# Altium project IMX8SoCIot.PrjPcb (part 3 of 4)

## Sheet IMX8_PMIC.SchDoc
size 594 x 420 mm; SheetNumber: 11; SheetTotal: 12
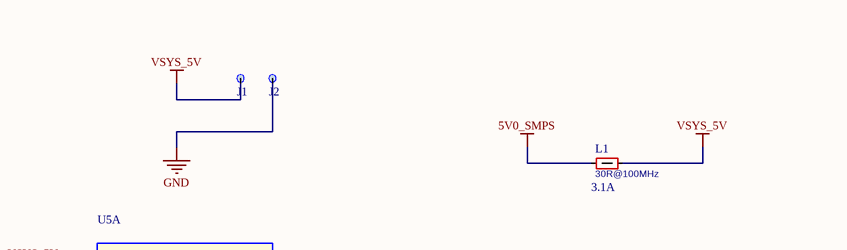
[diagram p16: IMX8_PMIC.SchDoc, top left]
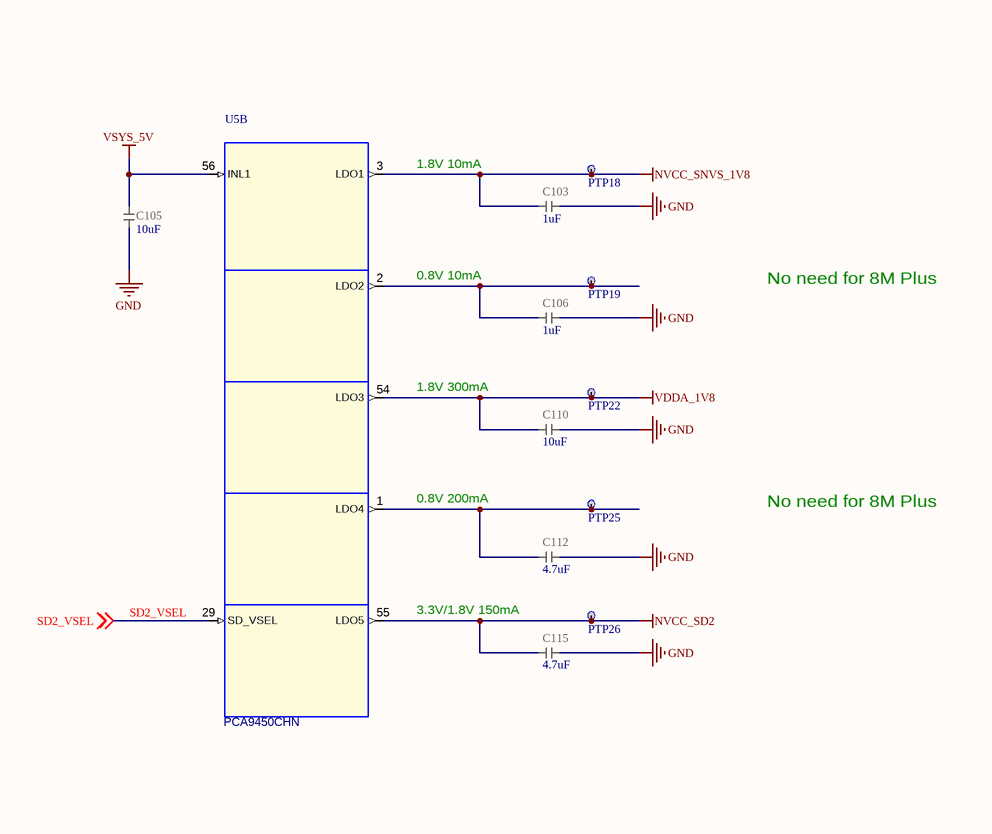
[diagram p17: IMX8_PMIC.SchDoc, top right]
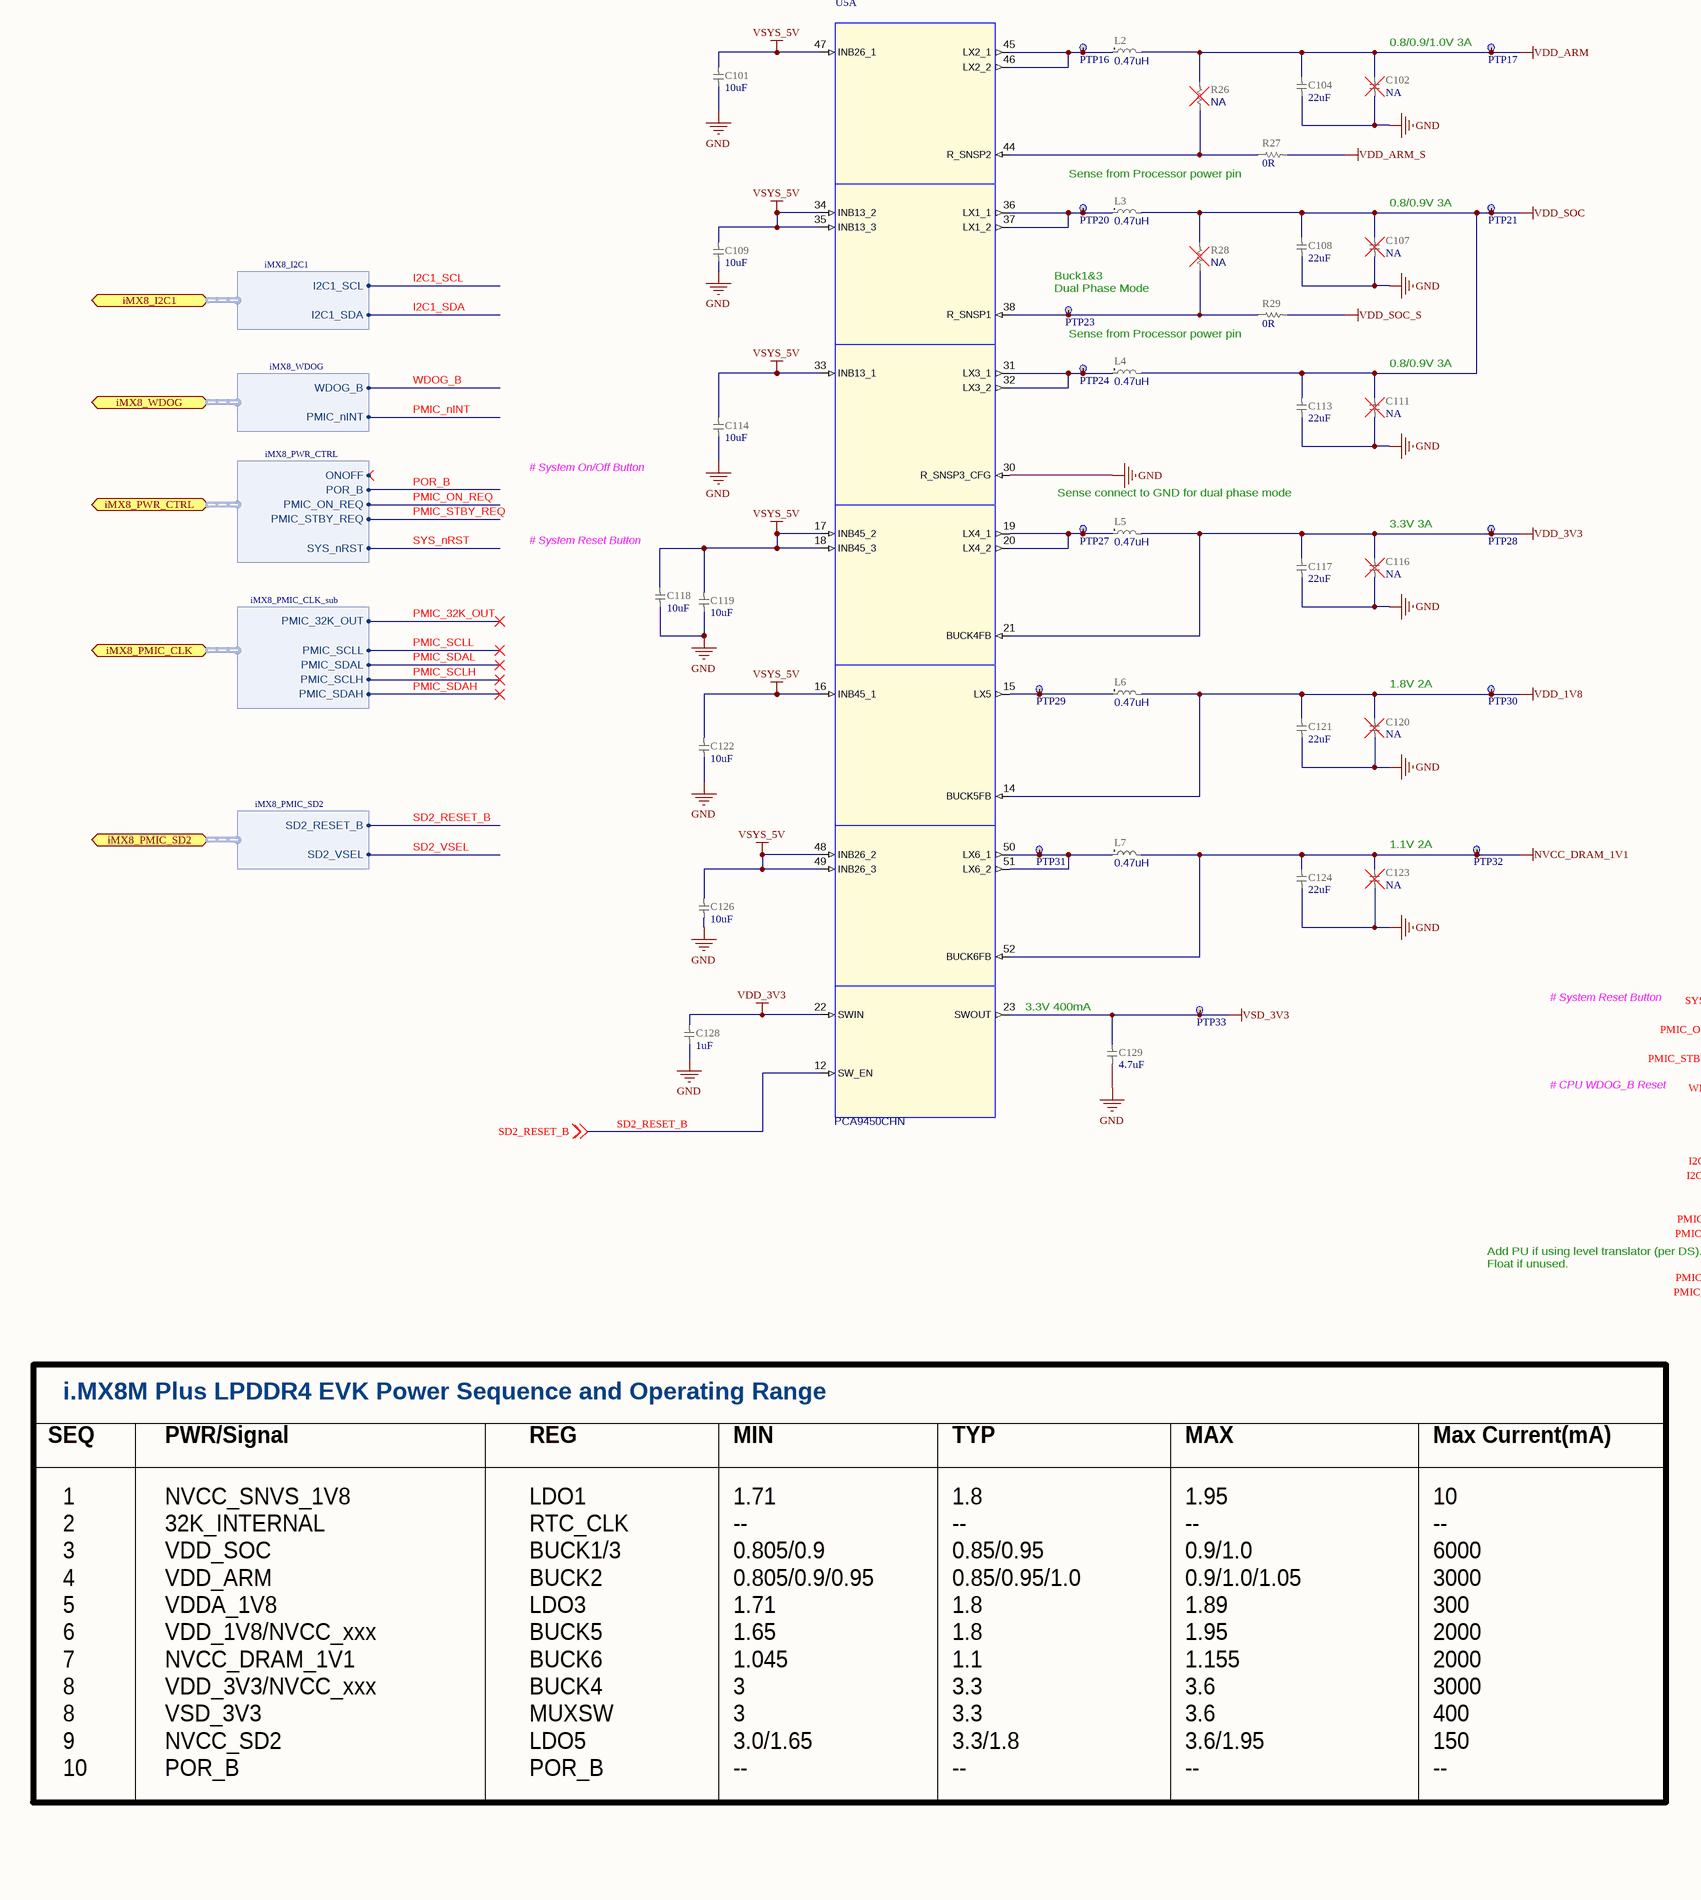
[diagram p18: IMX8_PMIC.SchDoc, bottom left]
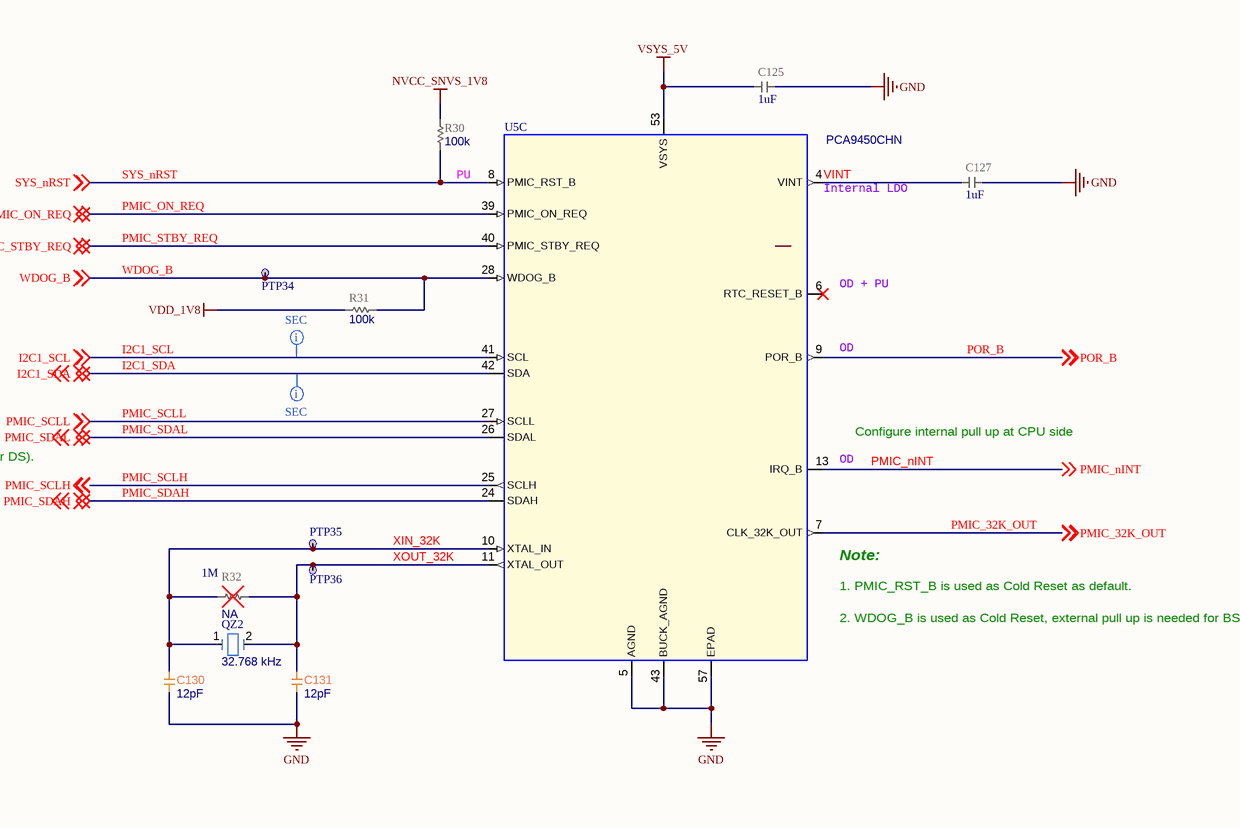
[diagram p19: IMX8_PMIC.SchDoc, bottom right]

### Parts
C101  value 10uF  [CAP_0603_UN1Q]  (hidden comment: CAP_0603_10u_10V_X7R)
C102  value NA  [CAP_0603_UN1Q]  (hidden comment: CAP_0603_NA)
C103  value 1uF  [CAP_0201_UN1Q]  (hidden comment: CAP_0201_1uF_X6S)
C104  value 22uF  [CAP_0603_UN1Q]  (hidden comment: CAP_0603_22u_6.3V_X6S)
C105  value 10uF  [CAP_0603_UN1Q]  (hidden comment: CAP_0603_10u_10V_X7R)
C106  value 1uF  [CAP_0201_UN1Q]  (hidden comment: CAP_0201_1uF_X6S)
C107  value NA  [CAP_0603_UN1Q]  (hidden comment: CAP_0603_NA)
C108  value 22uF  [CAP_0603_UN1Q]  (hidden comment: CAP_0603_22u_6.3V_X6S)
C109  value 10uF  [CAP_0603_UN1Q]  (hidden comment: CAP_0603_10u_10V_X7R)
C110  value 10uF  [CAP_0402_H09W07_UN1Q]  (hidden comment: CAP_0402_10u_X6S)
C111  value NA  [CAP_0603_UN1Q]  (hidden comment: CAP_0603_NA)
C112  value 4.7uF  [CAP_0402_H09W07_UN1Q]  (hidden comment: CAP_0402_4u7_10V_X6S)
C113  value 22uF  [CAP_0603_UN1Q]  (hidden comment: CAP_0603_22u_6.3V_X6S)
C114  value 10uF  [CAP_0603_UN1Q]  (hidden comment: CAP_0603_10u_10V_X7R)
C115  value 4.7uF  [CAP_0402_H09W07_UN1Q]  (hidden comment: CAP_0402_4u7_10V_X6S)
C116  value NA  [CAP_0603_UN1Q]  (hidden comment: CAP_0603_NA)
C117  value 22uF  [CAP_0603_UN1Q]  (hidden comment: CAP_0603_22u_6.3V_X6S)
C118  value 10uF  [CAP_0603_UN1Q]  (hidden comment: CAP_0603_10u_10V_X7R)
C119  value 10uF  [CAP_0603_UN1Q]  (hidden comment: CAP_0603_10u_10V_X7R)
C120  value NA  [CAP_0603_UN1Q]  (hidden comment: CAP_0603_NA)
C121  value 22uF  [CAP_0603_UN1Q]  (hidden comment: CAP_0603_22u_6.3V_X6S)
C122  value 10uF  [CAP_0603_UN1Q]  (hidden comment: CAP_0603_10u_10V_X7R)
C123  value NA  [CAP_0603_UN1Q]  (hidden comment: CAP_0603_NA)
C124  value 22uF  [CAP_0603_UN1Q]  (hidden comment: CAP_0603_22u_6.3V_X6S)
C125  value 1uF  [CAP_0402_UN1Q]  (hidden comment: CAP_0402_1uF_10V_X7R)
C126  value 10uF  [CAP_0603_UN1Q]  (hidden comment: CAP_0603_10u_10V_X7R)
C127  value 1uF  [CAP_0402_UN1Q]  (hidden comment: CAP_0402_1uF_10V_X7R)
C128  value 1uF  [CAP_0402_UN1Q]  (hidden comment: CAP_0402_1uF_10V_X7R)
C129  value 4.7uF  [CAP_0402_H09W07_UN1Q]  (hidden comment: CAP_0402_4u7_10V_X6S)
C130  value 12pF  [CAP_0201_UN1Q]  (hidden comment: CAP_0201_12pF_RF_MATCHING)
C131  value 12pF  [CAP_0201_UN1Q]  (hidden comment: CAP_0201_12pF_RF_MATCHING)
J1  PAD 1 x 2 mm  [TP_1x2mm_UN1Q]  (value not drawn)  (no BOM)
J2  PAD 1 x 2 mm  [TP_1x2mm_UN1Q]  (value not drawn)  (no BOM)
L1  value 30R@100MHz  Current: 3.1A  [FERR_BLM15KD]  (hidden comment: FERRITE_0402_BLM15KD)
L2  value 0.47uH  [IND_VLS2520]  (hidden comment: IND_VLS2520_0u47)
L3  value 0.47uH  [IND_VLS2520]  (hidden comment: IND_VLS2520_0u47)
L4  value 0.47uH  [IND_VLS2520]  (hidden comment: IND_VLS2520_0u47)
L5  value 0.47uH  [IND_VLS2520]  (hidden comment: IND_VLS2520_0u47)
L6  value 0.47uH  [IND_VLS2520]  (hidden comment: IND_VLS2520_0u47)
L7  value 0.47uH  [IND_VLS2520]  (hidden comment: IND_VLS2520_0u47)
PTP16  PTP_0.4mm  [PTP_0.4mm]  (value not drawn)  (no BOM)
PTP17  PTP_0.4mm  [PTP_0.4mm]  (value not drawn)  (no BOM)
PTP18  PTP_0.4mm  [PTP_0.4mm]  (value not drawn)  (no BOM)
PTP19  PTP_0.4mm  [PTP_0.4mm]  (value not drawn)  (no BOM)
PTP20  PTP_0.4mm  [PTP_0.4mm]  (value not drawn)  (no BOM)
PTP21  PTP_0.4mm  [PTP_0.4mm]  (value not drawn)  (no BOM)
PTP22  PTP_0.4mm  [PTP_0.4mm]  (value not drawn)  (no BOM)
PTP23  PTP_0.4mm  [PTP_0.4mm]  (value not drawn)  (no BOM)
PTP24  PTP_0.4mm  [PTP_0.4mm]  (value not drawn)  (no BOM)
PTP25  PTP_0.4mm  [PTP_0.4mm]  (value not drawn)  (no BOM)
PTP26  PTP_0.4mm  [PTP_0.4mm]  (value not drawn)  (no BOM)
PTP27  PTP_0.4mm  [PTP_0.4mm]  (value not drawn)  (no BOM)
PTP28  PTP_0.4mm  [PTP_0.4mm]  (value not drawn)  (no BOM)
PTP29  PTP_0.4mm  [PTP_0.4mm]  (value not drawn)  (no BOM)
PTP30  PTP_0.4mm  [PTP_0.4mm]  (value not drawn)  (no BOM)
PTP31  PTP_0.4mm  [PTP_0.4mm]  (value not drawn)  (no BOM)
PTP32  PTP_0.4mm  [PTP_0.4mm]  (value not drawn)  (no BOM)
PTP33  PTP_0.4mm  [PTP_0.4mm]  (value not drawn)  (no BOM)
PTP34  PTP_0.4mm  [PTP_0.4mm]  (value not drawn)  (no BOM)
PTP35  PTP_0.4mm  [PTP_0.4mm]  (value not drawn)  (no BOM)
PTP36  PTP_0.4mm  [PTP_0.4mm]  (value not drawn)  (no BOM)
QZ2  value 32.768 kHz  [CM8V32768TA020125_MC]  (hidden comment: XTAL_CM8V-T1A-32_768KHZ-9PF-20PPM-TA-QC)
R26  value NA  [RES_0201_UN1Q]  (hidden comment: RES_0201_NA)
R27  value 0R  [RES_0201_UN1Q]  (hidden comment: RES_0201_0R)
R28  value NA  [RES_0201_UN1Q]  (hidden comment: RES_0201_NA)
R29  value 0R  [RES_0201_UN1Q]  (hidden comment: RES_0201_0R)
R30  value 100k  [RES_0201_UN1Q]  (hidden comment: RES_0201_100k)
R31  value 100k  [RES_0201_UN1Q]  (hidden comment: RES_0201_100k)
R32  value NA  [RES_0201_UN1Q]  (hidden comment: RES_0201_NA)
U5  Part Number: PCA9450CHN  [QFN57P40_700X700X100NXP]  (hidden comment: PCA9450_HVQFN56P_A)  (parts A,B,C of 3)

### Ports
iMX8_I2C1 (bidir, harness iMX8_I2C1), iMX8_PMIC_CLK (bidir, harness iMX8_PMIC_CLK_sub), iMX8_PMIC_SD2 (bidir, harness iMX8_PMIC_SD2), iMX8_PWR_CTRL (bidir, harness iMX8_PWR_CTRL), iMX8_WDOG (bidir, harness iMX8_WDOG)

### Harnesses
iMX8_PMIC_CLK_sub: PMIC_32K_OUT, PMIC_SCLL, PMIC_SDAL, PMIC_SCLH, PMIC_SDAH
iMX8_WDOG: WDOG_B, PMIC_nINT
iMX8_I2C1: I2C1_SCL, I2C1_SDA
iMX8_PWR_CTRL: ONOFF, POR_B, PMIC_ON_REQ, PMIC_STBY_REQ, SYS_nRST
iMX8_PMIC_SD2: SD2_RESET_B, SD2_VSEL

### Nets
5V0_SMPS: L1.1
GND: C101.1 C102.2 C103.2 C104.1 C105.1 C106.2 C107.2 C108.1 C109.1 C110.2 C111.2 C112.1 C113.1 C114.1 C115.1 C116.2 C117.1 C118.1 C119.1 C120.1 C121.2 C122.1 C123.2 C124.1 C125.1 C126.1 C127.1 C128.1 C129.2 C130.2 C131.2 J2.1(TP) U5.5(AGND) U5.30(R_SNSP3_CFG) U5.43(BUCK_AGND) U5.57(EPAD)
NVCC_DRAM_1V1: C123.1 C124.2 L7.2 PTP32.1(TP) U5.52(BUCK6FB)
NVCC_SD2: C115.2 PTP26.1(TP) U5.55(LDO5)
NVCC_SNVS_1V8: C103.1 PTP18.1(TP) R30.1 U5.3(LDO1)
VDD_1V8: C120.2 C121.1 L6.2 PTP30.1(TP) R31.1 U5.14(BUCK5FB)
VDD_3V3: C116.1 C117.2 C128.2 L5.2 PTP28.1(TP) U5.21(BUCK4FB) U5.22(SWIN)
VDD_ARM: C102.1 C104.2 L2.2 PTP17.1(TP) R26.2 R27.2  [also labelled VDD_ARM_S]
VDD_SOC: C107.1 C108.2 C111.1 C113.2 L3.2 L4.2 PTP21.1(TP) R28.2 R29.2  [also labelled VDD_SOC_S]
VDDA_1V8: C110.1 PTP22.1(TP) U5.54(LDO3)
VSD_3V3: C129.1 PTP33.1(TP) U5.23(SWOUT)
VSYS_5V: C101.2 C105.2 C109.2 C114.2 C118.2 C119.2 C122.2 C125.2 C126.2 J1.1(TP) L1.2 U5.16(INB45_1) U5.17(INB45_2) U5.18(INB45_3) U5.33(INB13_1) U5.34(INB13_2) U5.35(INB13_3) U5.47(INB26_1) U5.48(INB26_2) U5.49(INB26_3) U5.53(VSYS) U5.56(INL1)
I2C1_SCL: U5.41(SCL) ; off-sheet I2C1_SCL, port iMX8_I2C1.I2C1_SCL
I2C1_SDA: U5.42(SDA) ; off-sheet I2C1_SDA, port iMX8_I2C1.I2C1_SDA
PMIC_32K_OUT: U5.7(CLK_32K_OUT) ; off-sheet PMIC_32K_OUT, port iMX8_PMIC_CLK.PMIC_32K_OUT
PMIC_nINT: U5.13(IRQ_B) ; off-sheet PMIC_nINT, port iMX8_WDOG.PMIC_nINT
PMIC_ON_REQ: U5.39(PMIC_ON_REQ) ; off-sheet PMIC_ON_REQ, port iMX8_PWR_CTRL.PMIC_ON_REQ
PMIC_SCLH: U5.25(SCLH) ; off-sheet PMIC_SCLH, port iMX8_PMIC_CLK.PMIC_SCLH
PMIC_SCLL: U5.27(SCLL) ; off-sheet PMIC_SCLL, port iMX8_PMIC_CLK.PMIC_SCLL
PMIC_SDAH: U5.24(SDAH) ; off-sheet PMIC_SDAH, port iMX8_PMIC_CLK.PMIC_SDAH
PMIC_SDAL: U5.26(SDAL) ; off-sheet PMIC_SDAL, port iMX8_PMIC_CLK.PMIC_SDAL
PMIC_STBY_REQ: U5.40(PMIC_STBY_REQ) ; off-sheet PMIC_STBY_REQ, port iMX8_PWR_CTRL.PMIC_STBY_REQ
POR_B: U5.9(POR_B) ; off-sheet POR_B, port iMX8_PWR_CTRL.POR_B
SD2_RESET_B: U5.12(SW_EN) ; off-sheet SD2_RESET_B, port iMX8_PMIC_SD2.SD2_RESET_B
SD2_VSEL: U5.29(SD_VSEL) ; off-sheet SD2_VSEL, port iMX8_PMIC_SD2.SD2_VSEL
SYS_nRST: R30.2 U5.8(PMIC_RST_B) ; off-sheet SYS_nRST, port iMX8_PWR_CTRL.SYS_nRST
VINT: C127.2 U5.4(VINT)
WDOG_B: PTP34.1(TP) R31.2 U5.28(WDOG_B) ; off-sheet WDOG_B, port iMX8_WDOG.WDOG_B
XIN_32K: C130.1 PTP35.1(TP) QZ2.1 R32.1 U5.10(XTAL_IN)
XOUT_32K: C131.1 PTP36.1(TP) QZ2.2 R32.2 U5.11(XTAL_OUT)
NetC106_1: C106.1 PTP19.1(TP) U5.2(LDO2)
NetC112_2: C112.2 PTP25.1(TP) U5.1(LDO4)
NetL2_1: L2.1 PTP16.1(TP) U5.45(LX2_1) U5.46(LX2_2)
NetL3_1: L3.1 PTP20.1(TP) U5.36(LX1_1) U5.37(LX1_2)
NetL4_1: L4.1 PTP24.1(TP) U5.31(LX3_1) U5.32(LX3_2)
NetL5_1: L5.1 PTP27.1(TP) U5.19(LX4_1) U5.20(LX4_2)
NetL6_1: L6.1 PTP29.1(TP) U5.15(LX5)
NetL7_1: L7.1 PTP31.1(TP) U5.50(LX6_1) U5.51(LX6_2)
NetPTP23_1: PTP23.1(TP) R28.1 R29.1 U5.38(R_SNSP1)
NetR26_1: R26.1 R27.1 U5.44(R_SNSP2)

Not connected (* = marked no-connect by the designer): U5 6(RTC_RESET_B)*

### Layout directives
net class SEC: I2C1_SCL, I2C1_SDA

### Notes on the sheet
- (near PTP17) 0.8/0.9/1.0V 3A
- (near U5) 1.8V 10mA
- Sense from Processor power pin
- (near U5) 0.8V 10mA
- No need for 8M Plus
- 0.8/0.9V 3A
- (near PTP23) Buck1&3
  Dual Phase Mode
- 1.8V 300mA
- (near C111) 0.8/0.9V 3A
- (near U5) 0.8V 200mA
- # System On/Off Button
- Sense connect to GND for dual phase mode
- 3.3V/1.8V 150mA
- (near C118) # System Reset Button
- (near C116) 3.3V 3A
- (near C120) 1.8V 2A
- (near C123) 1.1V 2A
- 3.3V 400mA
- # System Reset Button
- PU
- (near U5) Internal LDO
- # CPU WDOG_B Reset
- (near U5) OD + PU
- (near U5) OD
- (near U5) Configure internal pull up at CPU side
- Add PU if using level translator (per DS).
  Float if unused.
- (near R32) 1M
- (near U5) Note:
- i.MX8M Plus LPDDR4 EVK Power Sequence and Operating Range
- (near U5) 1. PMIC_RST_B is used as Cold Reset as default.
- (near U5) 2. WDOG_B is used as Cold Reset, external pull up is needed for BSDL mode.
- SEQ
- PWR/Signal
- REG
- MIN
- TYP
- MAX
- Max Current(mA)
- NVCC_SNVS_1V8
  32K_INTERNAL
  VDD_SOC
  VDD_ARM
  VDDA_1V8
  VDD_1V8/NVCC_xxx
  NVCC_DRAM_1V1
  VDD_3V3/NVCC_xxx
  VSD_3V3
  NVCC_SD2
  POR_B
- LDO1
  RTC_CLK
  BUCK1/3
  BUCK2
  LDO3
  BUCK5
  BUCK6
  BUCK4
  MUXSW
  LDO5
  POR_B
- 1.71
  --
  0.805/0.9
  0.805/0.9/0.95
  1.71
  1.65
  1.045
  3
  3
  3.0/1.65
  --
- 1.8
  --
  0.85/0.95
  0.85/0.95/1.0
  1.8
  1.8
  1.1
  3.3
  3.3
  3.3/1.8
  --
- 1.95
  --
  0.9/1.0
  0.9/1.0/1.05
  1.89
  1.95
  1.155
  3.6
  3.6
  3.6/1.95
  --
- 10
  --
  6000
  3000
  300
  2000
  2000
  3000
  400
  150
  --
- 1
  2
  3
  4
  5
  6
  7
  8
  8
  9
  10
- DWG NO:
- REV:
- THIS DOCUMENT AND THE DATA DISCLOSED HEREIN OR
- HEREWITH IS THE PROPERTY OF ALTIUM LIMITED AND MAY
- BE FREELY DISTRIBUTED IN WHOLE. NO RIGHTS ARE
- RESERVED OR EXPRESS OR IMPLIED WARANTEE GIVEN.
- REVISION
- DESCRIPTION
- DATE
- APPROVED
- ENG:
- APPROVALS
- PROJECT
- DSN:
- CHK:
- REFERENCE DOCUMENTS
- PROJECT REVISION:
- TITLE
- DOCUMENT REVISION:
- DESIGN ITEM:
- BOM:
- FAB DWG:
- PCB DWG:
- ASSY DWG:
- SCALE:
- A2
- SIZE
- CAGE CODE
- FILE NAME
- DWG NO.
- SHEET
- OF
- REV

### Library data of the parts
C101 C105 C109 C114 C118 C119 C122 C126 = CMP-001-001253-9: CAP; Part Number: GRM188Z71A106KA73D; Manufacturer: Murata; Voltage: 10V; Tolerance: +/-10%; Temperature characteristics: X7R; Sort order: 306; Alternative component: Allowed; System: RLC; Package: 0603; ComponentLink1Description: 1_Datasheet; ComponentLink2Description: 2_Product page; ComponentLink3Description: 3_X-information; ComponentLink4Description: 4_X-information; Creation date: 20240404; Manufacturer Part Number: GRM188Z71A106KA73D; Component Type: Capacitor
C102 C107 C111 C116 C120 C123 = CMP-001-000259-10: Not Assembled - CAP; Sort order: 999; System: RLC; HasBeenBuilt: TBD; Creation date: 20190101; Package: 0603; Source: RLC_UN1Q.SchLib; ComponentLink3Description: 3_X-information; ComponentLink1Description: 1_Datasheet; ComponentLink2Description: 2_Product page; ComponentLink4Description: 4_X-information; Component Type: Capacitor
C103 C106 = CMP-001-000336-15: CAP; Part Number: KGM03CS61A105MH; Manufacturer: KYOCERA AVX; Temperature characteristics: X6S; Voltage: 10V; Tolerance: +/-20%; Sort order: 302; HasBeenBuilt: False; Alternative component: Allowed; System: RLC; Package: 0201; Operating temperature range: -55C to +105C; ClassName: SMALL; ComponentLink1Description: 1_Datasheet; ComponentLink2Description: 2_Product page; ComponentLink3Description: 3_X-information; ComponentLink4Description: 4_X-information; Creation date: 20190101; Source: RLC_UN1Q.SchLib; Manufacturer Part Number: KGM03CS61A105MH; Component Type: Capacitor
C104 C108 C113 C117 C121 C124 = CMP-001-000890-13: CAP; Part Number: GRM188C80J226ME15D; Manufacturer: Murata; Voltage: 6.3V; Tolerance: +/-20%; Temperature characteristics: X6S; Sort order: 306; HasBeenBuilt: TBD; Alternative component: Allowed; System: RLC; Package: 0603; ComponentLink1Description: 1_Datasheet; ComponentLink2Description: 2_Product page; ComponentLink3Description: 3_X-information; ComponentLink4Description: 4_X-information; Creation date: 26042024; Manufacturer Part Number: GRM188C80J226ME15D; Component Type: Capacitor
C110 = CMP-001-000883-14: CAP; Part Number: GMC04X6S106M6R3NT; Manufacturer: Cal-Chip Electronics; Voltage: 6.3V; Tolerance: +/-20%; Temperature characteristics: X6S; Sort order: 304; HasBeenBuilt: TBD; Alternative component: Allowed; System: RLC; Package: 0402; ComponentLink1Description: 1_Datasheet; ComponentLink2Description: 2_Product page; ComponentLink3Description: 3_X-information; ComponentLink4Description: 4_X-information; Creation date: 26042024; Manufacturer Part Number: GMC04X6S106M6R3NT; Component Type: Capacitor
C112 C115 C129 = CMP-001-000888-12: CAP; Part Number: GRT155C81A475ME13J; Manufacturer: Murata; Sort order: 304; HasBeenBuilt: TBD; Alternative component: Allowed; System: RLC; Voltage: 10V; Temperature characteristics: X6S; Tolerance: +/-10%; ComponentLink2Description: 2_Product page; Package: 0402; Creation date: 26042024; ComponentLink1Description: 1_Datasheet; ComponentLink3Description: 3_X-information; ComponentLink4Description: 4_X-information; Manufacturer Part Number: GRT155C81A475ME13J; Component Type: Capacitor
C125 C127 C128 = CMP-001-001247-9: CAP; Part Number: GRM155Z71A105KE01J; Manufacturer: Murata; Temperature characteristics: X7R; Voltage: 10V; Tolerance: +/-10%; Sort order: 304; Alternative component: Allowed; System: RLC; Package: 0402; ComponentLink1Description: 1_Datasheet; ComponentLink2Description: 2_Product page; ComponentLink3Description: 3_X-information; ComponentLink4Description: 4_X-information; Creation date: 20240404; Manufacturer Part Number: GRM155Z71A105KE01J; Component Type: Capacitor
C130 C131 = CMP-001-000420-11: CAP_RF_MATCHING; Part Number: GRM0335C1H120GA01; Manufacturer: Murata; Voltage: 50V; Tolerance: +/- 2%; Temperature characteristics: C0G; Remark: RF matching, use part number; Sort order: 202; HasBeenBuilt: TBD; System: RLC; Package: 0201; Operating temperature range: -55 ... +125C; ComponentLink1Description: 1_Datasheet; ComponentLink2Description: 2_Product page; ComponentLink3Description: 3_X-information; ComponentLink4Description: 4_X-information; Creation date: 20211123; ClassName: SMALL; Source: RLC_UN1Q.SchLib; Manufacturer Part Number: GRM0335C1H120GA01; Component Type: Capacitor
J1 J2 = CMP-001-000157-12: Part Number: TP 1x2mm; System: Test Point; Sort order: -; HasBeenBuilt: -; ClassName: SMALL; ComponentLink1Description: 1_Datasheet; ComponentLink2Description: 2_Product page; ComponentLink3Description: 3_X-information; ComponentLink4Description: 4_X-information; Creation date: 20200101; Source: Conn_UN1Q.SchLib; Design Item ID: TP_1x2mm; Component Type: Test Point
L1 = CMP-001-000738-12: FERRITE; Part Number: BLM15KD300SN1; Manufacturer: Murata; Manufacturer Part Number: BLM15KD300SN1D; Sort order: 364; HasBeenBuilt: Saluki2; System: Discrete; Package: 0402; Operating temperature range: -55 ... +125C; Dimensions WxLxH: 0.55mm; ComponentLink1Description: 1_Datasheet; ComponentLink1URL: https://www.murata.com/en-us/products/productdetail.aspx?cate=luNoiseSupprFilteChipFerriBead&partno=BLM15KD300SN1%23; ComponentLink2Description: 2_Product page; ComponentLink3Description: 3_X-information; ComponentLink4Description: 4_X-information; Creation date: 20200304; Source: Discrete_UN1Q.SchLib; ECCN: EAR99; RoHS: RoHS3; Component Type: Ferrite
L2-L7 = CMP-001-000947-11: IND, Low DCR shielded; Manufacturer: TDK; Part Number: VLS252012HBX-R47M-1; Sort order: 348; System: RLC; Package: 2520; Dimensions WxLxH: 2.5 x 2.0 x 1.2mm; ClassName: BIG; ComponentLink1Description: 1_Datasheet; ComponentLink1URL: https://product.tdk.com/en/system/files?file=dam/doc/product/inductor/inductor/smd/catalog/inductor_commercial_power_vls252012hbx-1_en.pdf; Operating temperature range: -40 ... +105 °C; Creation date: 09022024; Source: UUDET_KOMPONENTIT.SchLib; ComponentLink2Description: 2_Product page; ComponentLink3Description: 3_X-information; ComponentLink4Description: 4_X-information; Manufacturer Part Number: VLS252012HBX-R47M-1; Component Type: Inductor
PTP16-PTP34 = CMP-001-001296-3: as PTP6-PTP11 on sheet IMX8_LPDDR4; ComponentLink4Description: 4_X-information; ComponentLink1Description: 1_Datasheet; Sort order: -; ClassName: SMALL; System: Test Point; HasBeenBuilt: -; Design Item ID: PTP_0.4mm; ComponentLink3Description: 3_X-information; Creation date: 20240909; ComponentLink2Description: 2_Product page; Component Type: Test Point
PTP35 PTP36 = CMP-001-001296-3: Production Testpoint 0.4mm. Flying probe. Use 1mm pitch.; ComponentLink4Description: 4_X-information; ComponentLink1Description: 1_Datasheet; Part Number: PTP 0.4mm; Sort order: -; ClassName: SMALL; System: Test Point; HasBeenBuilt: -; Design Item ID: PTP_0.4mm; ComponentLink3Description: 3_X-information; Creation date: 20240909; ComponentLink2Description: 2_Product page
QZ2 = CMP-001-000697-8: SMT Quartz Crystal; Manufacturer: Micro Crystal; Part Number: CM8V-T1A-32.768KHZ-9PF-20PPM-TA-QC; HasBeenBuilt: SleeveIO_01; Sort order: 455; System: Discrete; ClassName: BIG; ComponentLink1Description: 1_Datasheet; ComponentLink1URL: https://www.microcrystal.com/fileadmin/Media/Products/32kHz/Datasheet/CM8V-T1A.pdf; ComponentLink2Description: 2_Product page; ComponentLink2URL: https://www.microcrystal.com/en/products/khz-quartz-crystals/cm8v-t1a/; ComponentLink3Description: 3_X-information; ComponentLink4Description: 4_X-information; Creation date: 20210913; Dimensions WxLxH: 1.2x2.0x0.6mm; Operating temperature range: -40 .... +85 °C; Package: 2-SMD; Source: Discrete_UN1Q.SchLib; Manufacturer Part Number: CM8V-T1A-32.768KHZ-9PF-20PPM-TA-QC; Component Type: Crystal & Oscillator
R26 R28 R32 = CMP-001-000434-10: as R8-R11 on sheet IMX8_LPDDR4; Package: 0201; ClassName: SMALL; ComponentLink1Description: 1_Datasheet; ComponentLink2Description: 2_Product page; ComponentLink3Description: 3_X-information; ComponentLink4Description: 4_X-information; Creation date: 20190101; Source: RLC_UN1Q.SchLib; Component Type: Resistor
R27 R29 = CMP-001-000429-13: RES; Part Number: RC0201JR-070RL; Manufacturer: YAGEO; Tolerance: 5%; Power Rating: 1/20W; Sort order: 322; HasBeenBuilt: TBD; Alternative component: Allowed; System: RLC; Package: 0201; ClassName: SMALL; ComponentLink1Description: 1_Datasheet; ComponentLink2Description: 2_Product page; ComponentLink3Description: 3_X-information; ComponentLink4Description: 4_X-information; Creation date: 20190101; Source: RLC_UN1Q.SchLib; Component Type: Resistor
R30 R31 = CMP-001-000526-11: RES; Part Number: RC0201FR-07100KL; Manufacturer: YAGEO; Tolerance: 1%; Power Rating: 1/20W; Sort order: 322; HasBeenBuilt: TBD; Alternative component: Allowed; System: RLC; Package: 0201; ClassName: SMALL; ComponentLink1Description: 1_Datasheet; ComponentLink2Description: 2_Product page; ComponentLink3Description: 3_X-information; ComponentLink4Description: 4_X-information; Creation date: 20190101; Source: RLC_UN1Q.SchLib; Component Type: Resistor
U5 = CMP-031-000204-7: POWER MANAGEMENT 2.7-5.5V HVQFN56; Manufacturer: NXP SEMICONDUCTORS; Sort order: 451; System: IC; ComponentLink1Description: 1_Datasheet; ComponentLink1URL: https://www.nxp.com/products/power-management/pmics-and-sbcs/pmics/power-management-ic-pmic-for-i-mx-8m-mini-nano-plus:PCA9450; ComponentLink2Description: 2_Product page; ComponentLink3Description: 3_X-information; ComponentLink4Description: 4_X-information; Creation date: 20240207; Dimensions WxLxH: 7.0x7.0x1.0; Operating temperature range: -40 .... +105 °C; Package: QFN56; Source: UUDET_KOMPONENTIT.SchLib; ClassName: BIG; Design Item ID: PCA9450CHN; Manufacturer Part Number: PCA9450CHN; Component Type: Power Supply

## Sheet IMX8_PWR.SchDoc
size 594 x 420 mm; SheetNumber: 5; SheetTotal: 12
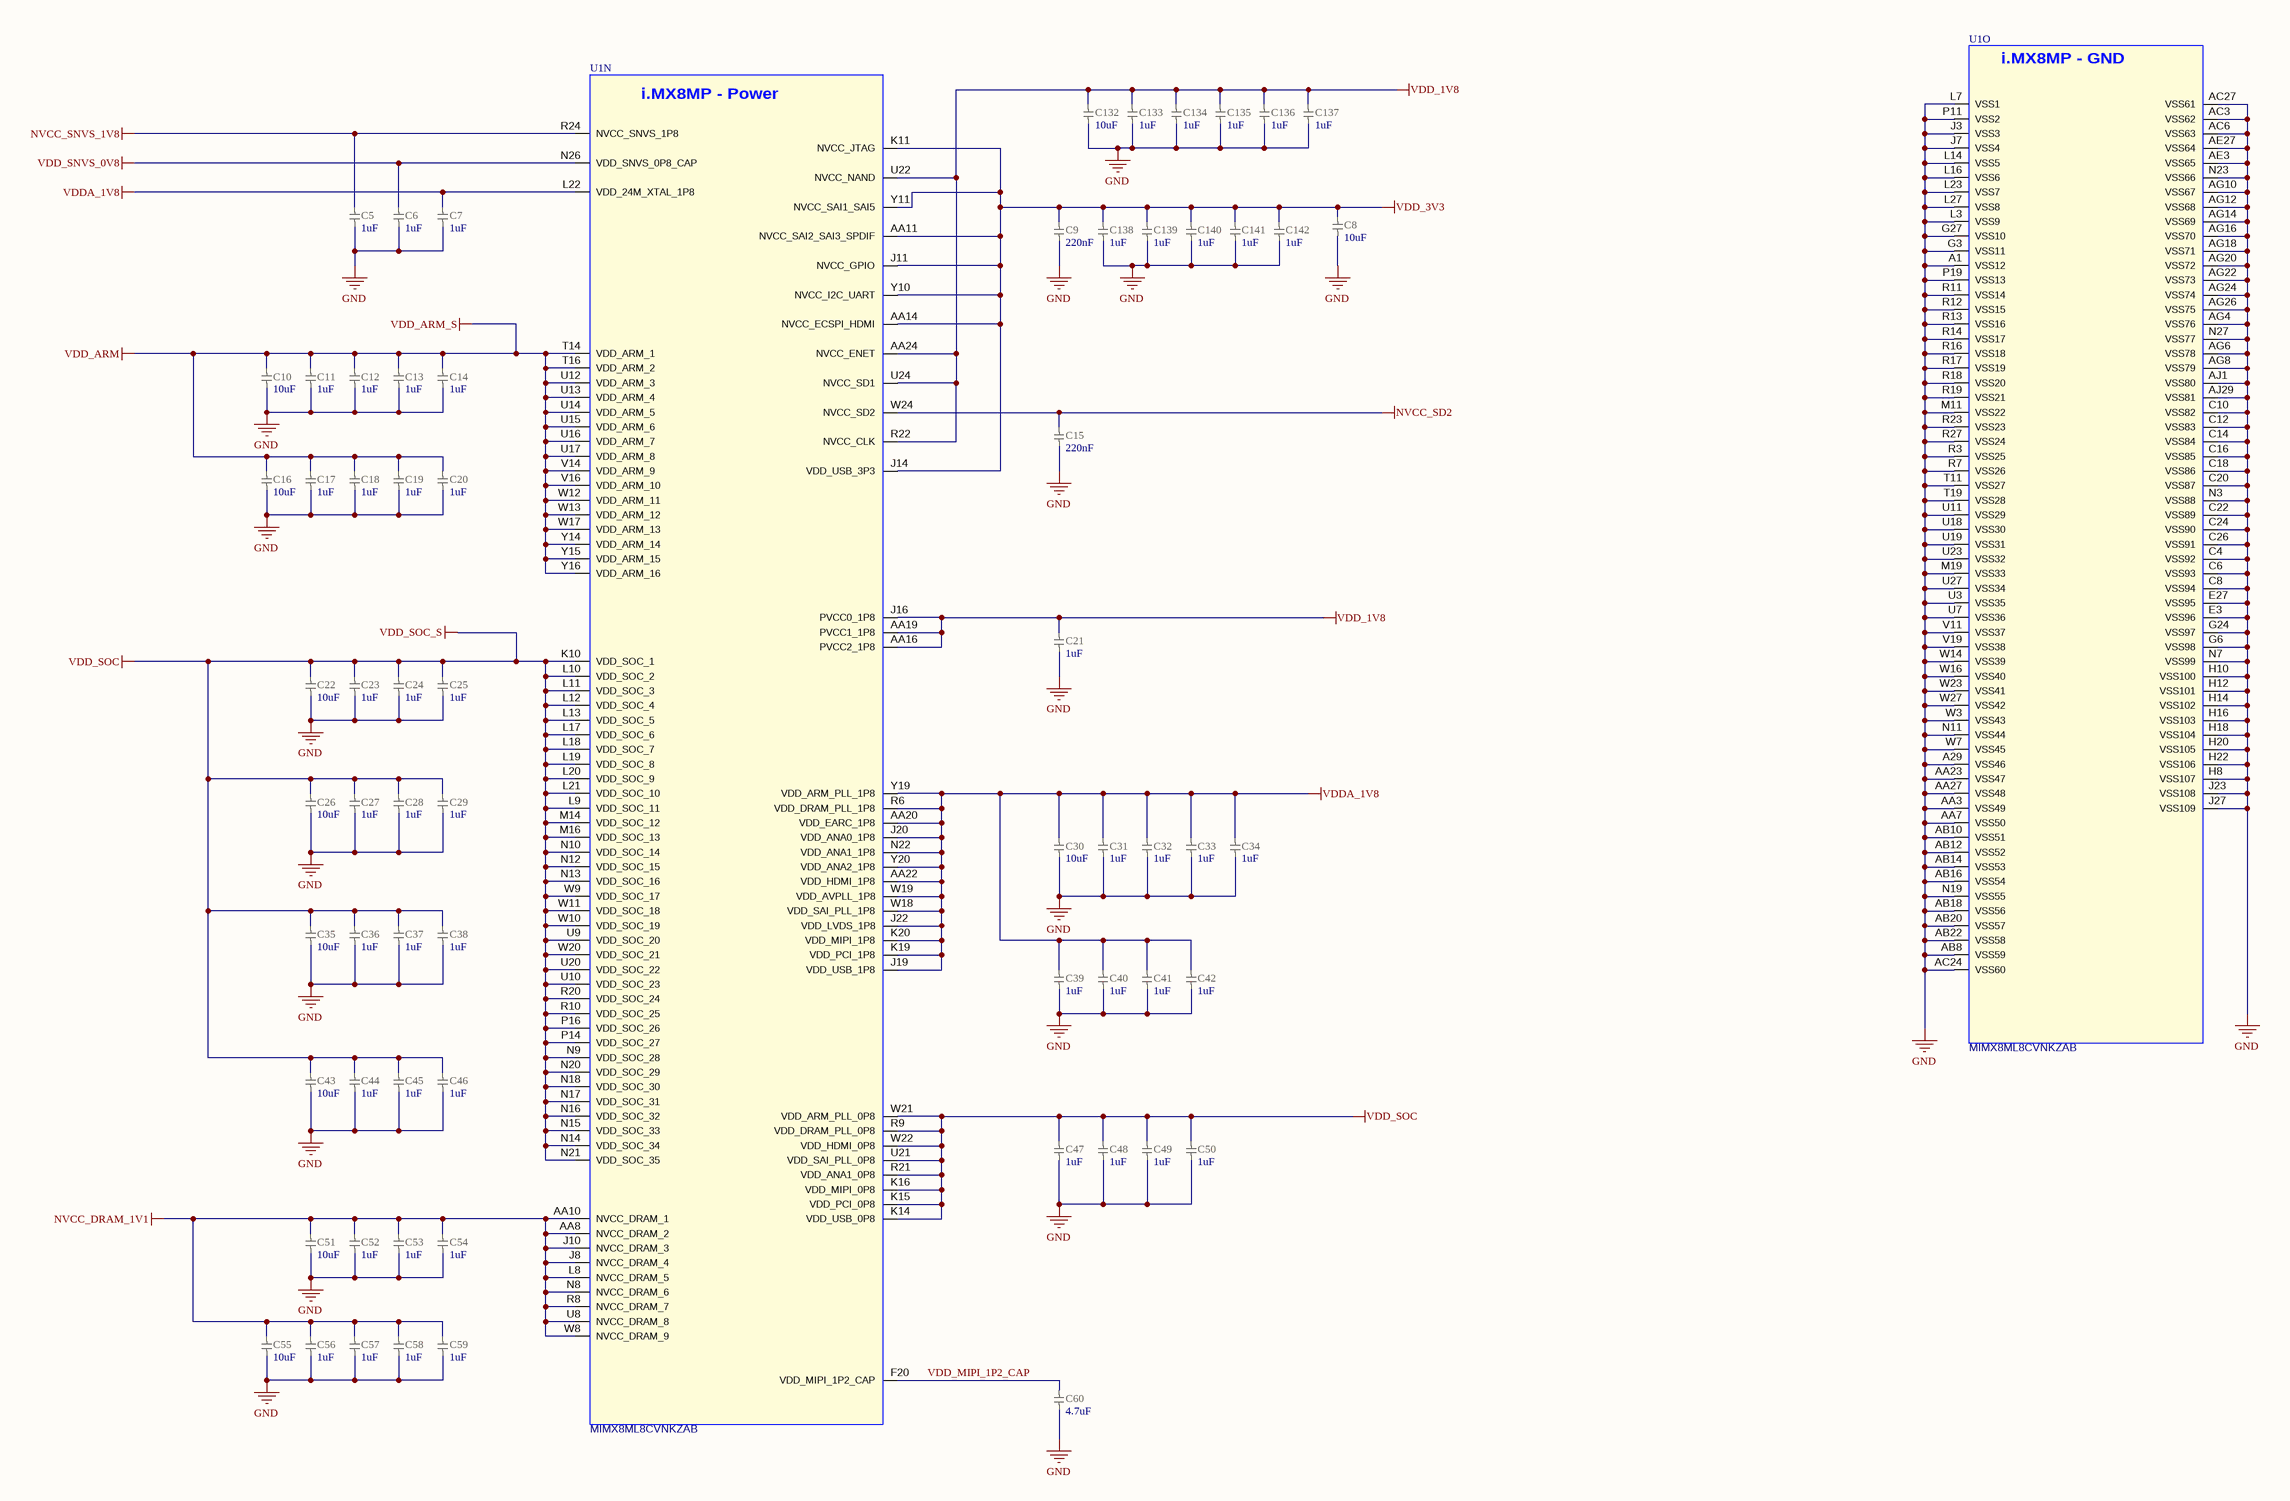
[diagram p20: IMX8_PWR.SchDoc]

### Parts
C5  value 1uF  [CAP_0201_UN1Q]  (hidden comment: CAP_0201_1uF_X6S)
C6  value 1uF  [CAP_0201_UN1Q]  (hidden comment: CAP_0201_1uF_X6S)
C7  value 1uF  [CAP_0201_UN1Q]  (hidden comment: CAP_0201_1uF_X6S)
C8  value 10uF  [CAP_0402_H09W07_UN1Q]  (hidden comment: CAP_0402_10u_X6S)
C9  value 220nF  [CAP_0201_UN1Q]  (hidden comment: CAP_0201_220n_10V_X6S)
C10  value 10uF  [CAP_0402_H09W07_UN1Q]  (hidden comment: CAP_0402_10u_X6S)
C11  value 1uF  [CAP_0201_UN1Q]  (hidden comment: CAP_0201_1uF_X6S)
C12  value 1uF  [CAP_0201_UN1Q]  (hidden comment: CAP_0201_1uF_X6S)
C13  value 1uF  [CAP_0201_UN1Q]  (hidden comment: CAP_0201_1uF_X6S)
C14  value 1uF  [CAP_0201_UN1Q]  (hidden comment: CAP_0201_1uF_X6S)
C15  value 220nF  [CAP_0201_UN1Q]  (hidden comment: CAP_0201_220n_10V_X6S)
C16  value 10uF  [CAP_0402_H09W07_UN1Q]  (hidden comment: CAP_0402_10u_X6S)
C17  value 1uF  [CAP_0201_UN1Q]  (hidden comment: CAP_0201_1uF_X6S)
C18  value 1uF  [CAP_0201_UN1Q]  (hidden comment: CAP_0201_1uF_X6S)
C19  value 1uF  [CAP_0201_UN1Q]  (hidden comment: CAP_0201_1uF_X6S)
C20  value 1uF  [CAP_0201_UN1Q]  (hidden comment: CAP_0201_1uF_X6S)
C21  value 1uF  [CAP_0201_UN1Q]  (hidden comment: CAP_0201_1uF_X6S)
C22  value 10uF  [CAP_0402_H09W07_UN1Q]  (hidden comment: CAP_0402_10u_X6S)
C23  value 1uF  [CAP_0201_UN1Q]  (hidden comment: CAP_0201_1uF_X6S)
C24  value 1uF  [CAP_0201_UN1Q]  (hidden comment: CAP_0201_1uF_X6S)
C25  value 1uF  [CAP_0201_UN1Q]  (hidden comment: CAP_0201_1uF_X6S)
C26  value 10uF  [CAP_0402_H09W07_UN1Q]  (hidden comment: CAP_0402_10u_X6S)
C27  value 1uF  [CAP_0201_UN1Q]  (hidden comment: CAP_0201_1uF_X6S)
C28  value 1uF  [CAP_0201_UN1Q]  (hidden comment: CAP_0201_1uF_X6S)
C29  value 1uF  [CAP_0201_UN1Q]  (hidden comment: CAP_0201_1uF_X6S)
C30  value 10uF  [CAP_0402_H09W07_UN1Q]  (hidden comment: CAP_0402_10u_X6S)
C31  value 1uF  [CAP_0201_UN1Q]  (hidden comment: CAP_0201_1uF_X6S)
C32  value 1uF  [CAP_0201_UN1Q]  (hidden comment: CAP_0201_1uF_X6S)
C33  value 1uF  [CAP_0201_UN1Q]  (hidden comment: CAP_0201_1uF_X6S)
C34  value 1uF  [CAP_0201_UN1Q]  (hidden comment: CAP_0201_1uF_X6S)
C35  value 10uF  [CAP_0402_H09W07_UN1Q]  (hidden comment: CAP_0402_10u_X6S)
C36  value 1uF  [CAP_0201_UN1Q]  (hidden comment: CAP_0201_1uF_X6S)
C37  value 1uF  [CAP_0201_UN1Q]  (hidden comment: CAP_0201_1uF_X6S)
C38  value 1uF  [CAP_0201_UN1Q]  (hidden comment: CAP_0201_1uF_X6S)
C39  value 1uF  [CAP_0201_UN1Q]  (hidden comment: CAP_0201_1uF_X6S)
C40  value 1uF  [CAP_0201_UN1Q]  (hidden comment: CAP_0201_1uF_X6S)
C41  value 1uF  [CAP_0201_UN1Q]  (hidden comment: CAP_0201_1uF_X6S)
C42  value 1uF  [CAP_0201_UN1Q]  (hidden comment: CAP_0201_1uF_X6S)
C43  value 10uF  [CAP_0402_H09W07_UN1Q]  (hidden comment: CAP_0402_10u_X6S)
C44  value 1uF  [CAP_0201_UN1Q]  (hidden comment: CAP_0201_1uF_X6S)
C45  value 1uF  [CAP_0201_UN1Q]  (hidden comment: CAP_0201_1uF_X6S)
C46  value 1uF  [CAP_0201_UN1Q]  (hidden comment: CAP_0201_1uF_X6S)
C47  value 1uF  [CAP_0201_UN1Q]  (hidden comment: CAP_0201_1uF_X6S)
C48  value 1uF  [CAP_0201_UN1Q]  (hidden comment: CAP_0201_1uF_X6S)
C49  value 1uF  [CAP_0201_UN1Q]  (hidden comment: CAP_0201_1uF_X6S)
C50  value 1uF  [CAP_0201_UN1Q]  (hidden comment: CAP_0201_1uF_X6S)
C51  value 10uF  [CAP_0402_H09W07_UN1Q]  (hidden comment: CAP_0402_10u_X6S)
C52  value 1uF  [CAP_0201_UN1Q]  (hidden comment: CAP_0201_1uF_X6S)
C53  value 1uF  [CAP_0201_UN1Q]  (hidden comment: CAP_0201_1uF_X6S)
C54  value 1uF  [CAP_0201_UN1Q]  (hidden comment: CAP_0201_1uF_X6S)
C55  value 10uF  [CAP_0402_H09W07_UN1Q]  (hidden comment: CAP_0402_10u_X6S)
C56  value 1uF  [CAP_0201_UN1Q]  (hidden comment: CAP_0201_1uF_X6S)
C57  value 1uF  [CAP_0201_UN1Q]  (hidden comment: CAP_0201_1uF_X6S)
C58  value 1uF  [CAP_0201_UN1Q]  (hidden comment: CAP_0201_1uF_X6S)
C59  value 1uF  [CAP_0201_UN1Q]  (hidden comment: CAP_0201_1uF_X6S)
C60  value 4.7uF  [CAP_0402_H09W07_UN1Q]  (hidden comment: CAP_0402_4u7_10V_X6S)
C132  value 10uF  [CAP_0402_H09W07_UN1Q]  (hidden comment: CAP_0402_10u_X6S)
C133  value 1uF  [CAP_0201_UN1Q]  (hidden comment: CAP_0201_1uF_X6S)
C134  value 1uF  [CAP_0201_UN1Q]  (hidden comment: CAP_0201_1uF_X6S)
C135  value 1uF  [CAP_0201_UN1Q]  (hidden comment: CAP_0201_1uF_X6S)
C136  value 1uF  [CAP_0201_UN1Q]  (hidden comment: CAP_0201_1uF_X6S)
C137  value 1uF  [CAP_0201_UN1Q]  (hidden comment: CAP_0201_1uF_X6S)
C138  value 1uF  [CAP_0201_UN1Q]  (hidden comment: CAP_0201_1uF_X6S)
C139  value 1uF  [CAP_0201_UN1Q]  (hidden comment: CAP_0201_1uF_X6S)
C140  value 1uF  [CAP_0201_UN1Q]  (hidden comment: CAP_0201_1uF_X6S)
C141  value 1uF  [CAP_0201_UN1Q]  (hidden comment: CAP_0201_1uF_X6S)
C142  value 1uF  [CAP_0201_UN1Q]  (hidden comment: CAP_0201_1uF_X6S)
U1  MIMX8ML8CVNKZAB  [BGA548C50P29X29_1500X1500X148]  (parts N,O of 15)

### Nets
GND: C5.1 C6.1 C7.1 C8.1 C9.1 C10.1 C11.1 C12.1 C13.1 C14.1 C15.1 C16.1 C17.1 C18.1 C19.1 C20.1 C21.1 C22.1 C23.1 C24.1 C25.1 C26.1 C27.1 C28.1 C29.1 C30.1 C31.1 C32.1 C33.1 C34.1 C35.1 C36.1 C37.1 C38.1 C39.1 C40.1 C41.1 C42.1 C43.1 C44.1 C45.1 C46.1 C47.1 C48.1 C49.1 C50.1 C51.1 C52.1 C53.1 C54.1 C55.1 C56.1 C57.1 C58.1 C59.1 C60.1 C132.1 C133.1 C134.1 C135.1 C136.1 C137.1 C138.1 C139.1 C140.1 C141.1 C142.1 U1.A1(VSS12) U1.A29(VSS46) U1.AA3(VSS49) U1.AA7(VSS50) U1.AA23(VSS47) U1.AA27(VSS48) U1.AB8(VSS59) U1.AB10(VSS51) U1.AB12(VSS52) U1.AB14(VSS53) U1.AB16(VSS54) U1.AB18(VSS56) U1.AB20(VSS57) U1.AB22(VSS58) U1.AC3(VSS62) U1.AC6(VSS63) U1.AC24(VSS60) U1.AC27(VSS61) U1.AE3(VSS65) U1.AE27(VSS64) U1.AG4(VSS76) U1.AG6(VSS78) U1.AG8(VSS79) U1.AG10(VSS67) U1.AG12(VSS68) U1.AG14(VSS69) U1.AG16(VSS70) U1.AG18(VSS71) U1.AG20(VSS72) U1.AG22(VSS73) U1.AG24(VSS74) U1.AG26(VSS75) U1.AJ1(VSS80) U1.AJ29(VSS81) U1.C4(VSS92) U1.C6(VSS93) U1.C8(VSS94) U1.C10(VSS82) U1.C12(VSS83) U1.C14(VSS84) U1.C16(VSS85) U1.C18(VSS86) U1.C20(VSS87) U1.C22(VSS89) U1.C24(VSS90) U1.C26(VSS91) U1.E3(VSS96) U1.E27(VSS95) U1.G3(VSS11) U1.G6(VSS98) U1.G24(VSS97) U1.G27(VSS10) U1.H8(VSS107) U1.H10(VSS100) U1.H12(VSS101) U1.H14(VSS102) U1.H16(VSS103) U1.H18(VSS104) U1.H20(VSS105) U1.H22(VSS106) U1.J3(VSS3) U1.J7(VSS4) U1.J23(VSS108) U1.J27(VSS109) U1.L3(VSS9) U1.L7(VSS1) U1.L14(VSS5) U1.L16(VSS6) U1.L23(VSS7) U1.L27(VSS8) U1.M11(VSS22) U1.M19(VSS33) U1.N3(VSS88) U1.N7(VSS99) U1.N11(VSS44) U1.N19(VSS55) U1.N23(VSS66) U1.N27(VSS77) U1.P11(VSS2) U1.P19(VSS13) U1.R3(VSS25) U1.R7(VSS26) U1.R11(VSS14) U1.R12(VSS15) U1.R13(VSS16) U1.R14(VSS17) U1.R16(VSS18) U1.R17(VSS19) U1.R18(VSS20) U1.R19(VSS21) U1.R23(VSS23) U1.R27(VSS24) U1.T11(VSS27) U1.T19(VSS28) U1.U3(VSS35) U1.U7(VSS36) U1.U11(VSS29) U1.U18(VSS30) U1.U19(VSS31) U1.U23(VSS32) U1.U27(VSS34) U1.V11(VSS37) U1.V19(VSS38) U1.W3(VSS43) U1.W7(VSS45) U1.W14(VSS39) U1.W16(VSS40) U1.W23(VSS41) U1.W27(VSS42)
NVCC_DRAM_1V1: C51.2 C52.2 C53.2 C54.2 C55.2 C56.2 C57.2 C58.2 C59.2 U1.AA8(NVCC_DRAM_2) U1.AA10(NVCC_DRAM_1) U1.J8(NVCC_DRAM_4) U1.J10(NVCC_DRAM_3) U1.L8(NVCC_DRAM_5) U1.N8(NVCC_DRAM_6) U1.R8(NVCC_DRAM_7) U1.U8(NVCC_DRAM_8) U1.W8(NVCC_DRAM_9)
NVCC_SD2: C15.2 U1.W24(NVCC_SD2)
NVCC_SNVS_1V8: C5.2 U1.R24(NVCC_SNVS_1P8)
VDD_1V8: C21.2 C132.2 C133.2 C134.2 C135.2 C136.2 C137.2 U1.AA16(PVCC2_1P8) U1.AA19(PVCC1_1P8) U1.AA24(NVCC_ENET) U1.J16(PVCC0_1P8) U1.R22(NVCC_CLK) U1.U22(NVCC_NAND) U1.U24(NVCC_SD1)
VDD_3V3: C8.2 C9.2 C138.2 C139.2 C140.2 C141.2 C142.2 U1.AA11(NVCC_SAI2_SAI3_SPDIF) U1.AA14(NVCC_ECSPI_HDMI) U1.J11(NVCC_GPIO) U1.J14(VDD_USB_3P3) U1.K11(NVCC_JTAG) U1.Y10(NVCC_I2C_UART) U1.Y11(NVCC_SAI1_SAI5)
VDD_ARM: C10.2 C11.2 C12.2 C13.2 C14.2 C16.2 C17.2 C18.2 C19.2 C20.2 U1.T14(VDD_ARM_1) U1.T16(VDD_ARM_2) U1.U12(VDD_ARM_3) U1.U13(VDD_ARM_4) U1.U14(VDD_ARM_5) U1.U15(VDD_ARM_6) U1.U16(VDD_ARM_7) U1.U17(VDD_ARM_8) U1.V14(VDD_ARM_9) U1.V16(VDD_ARM_10) U1.W12(VDD_ARM_11) U1.W13(VDD_ARM_12) U1.W17(VDD_ARM_13) U1.Y14(VDD_ARM_14) U1.Y15(VDD_ARM_15) U1.Y16(VDD_ARM_16)  [also labelled VDD_ARM_S]
VDD_SNVS_0V8: C6.2 U1.N26(VDD_SNVS_0P8_CAP)
VDD_SOC: C22.2 C23.2 C24.2 C25.2 C26.2 C27.2 C28.2 C29.2 C35.2 C36.2 C37.2 C38.2 C43.2 C44.2 C45.2 C46.2 C47.2 C48.2 C49.2 C50.2 U1.K10(VDD_SOC_1) U1.K14(VDD_USB_0P8) U1.K15(VDD_PCI_0P8) U1.K16(VDD_MIPI_0P8) U1.L9(VDD_SOC_11) U1.L10(VDD_SOC_2) U1.L11(VDD_SOC_3) U1.L12(VDD_SOC_4) U1.L13(VDD_SOC_5) U1.L17(VDD_SOC_6) U1.L18(VDD_SOC_7) U1.L19(VDD_SOC_8) U1.L20(VDD_SOC_9) U1.L21(VDD_SOC_10) U1.M14(VDD_SOC_12) U1.M16(VDD_SOC_13) U1.N9(VDD_SOC_28) U1.N10(VDD_SOC_14) U1.N12(VDD_SOC_15) U1.N13(VDD_SOC_16) U1.N14(VDD_SOC_34) U1.N15(VDD_SOC_33) U1.N16(VDD_SOC_32) U1.N17(VDD_SOC_31) U1.N18(VDD_SOC_30) U1.N20(VDD_SOC_29) U1.N21(VDD_SOC_35) U1.P14(VDD_SOC_27) U1.P16(VDD_SOC_26) U1.R9(VDD_DRAM_PLL_0P8) U1.R10(VDD_SOC_25) U1.R20(VDD_SOC_24) U1.R21(VDD_ANA1_0P8) U1.U9(VDD_SOC_20) U1.U10(VDD_SOC_23) U1.U20(VDD_SOC_22) U1.U21(VDD_SAI_PLL_0P8) U1.W9(VDD_SOC_17) U1.W10(VDD_SOC_19) U1.W11(VDD_SOC_18) U1.W20(VDD_SOC_21) U1.W21(VDD_ARM_PLL_0P8) U1.W22(VDD_HDMI_0P8)  [also labelled VDD_SOC_S]
VDDA_1V8: C7.2 C30.2 C31.2 C32.2 C33.2 C34.2 C39.2 C40.2 C41.2 C42.2 U1.AA20(VDD_EARC_1P8) U1.AA22(VDD_HDMI_1P8) U1.J19(VDD_USB_1P8) U1.J20(VDD_ANA0_1P8) U1.J22(VDD_LVDS_1P8) U1.K19(VDD_PCI_1P8) U1.K20(VDD_MIPI_1P8) U1.L22(VDD_24M_XTAL_1P8) U1.N22(VDD_ANA1_1P8) U1.R6(VDD_DRAM_PLL_1P8) U1.W18(VDD_SAI_PLL_1P8) U1.W19(VDD_AVPLL_1P8) U1.Y19(VDD_ARM_PLL_1P8) U1.Y20(VDD_ANA2_1P8)
VDD_MIPI_1P2_CAP: C60.2 U1.F20(VDD_MIPI_1P2_CAP)

### Notes on the sheet
- DWG NO:
- REV:
- THIS DOCUMENT AND THE DATA DISCLOSED HEREIN OR
- HEREWITH IS THE PROPERTY OF ALTIUM LIMITED AND MAY
- BE FREELY DISTRIBUTED IN WHOLE. NO RIGHTS ARE
- RESERVED OR EXPRESS OR IMPLIED WARANTEE GIVEN.
- REVISION
- DESCRIPTION
- DATE
- APPROVED
- ENG:
- APPROVALS
- PROJECT
- DSN:
- CHK:
- REFERENCE DOCUMENTS
- PROJECT REVISION:
- TITLE
- DOCUMENT REVISION:
- DESIGN ITEM:
- BOM:
- FAB DWG:
- PCB DWG:
- ASSY DWG:
- SCALE:
- A2
- SIZE
- CAGE CODE
- FILE NAME
- DWG NO.
- SHEET
- OF
- REV
- (in symbol CMP-001-000983-8, part N) i.MX8MP - Power
- (in symbol CMP-001-000983-8, part O) i.MX8MP - GND

### Library data of the parts
C5-C7 C11-C14 C17-C21 C23-C25 C27-C29 C31-C34 C36-C42 C44-C50 C52-C54 C56-C59 C133-C142 = CMP-001-000336-15: as C103 on sheet IMX8_PMIC; Package: 0201; Operating temperature range: -55C to +105C; ClassName: SMALL; ComponentLink1Description: 1_Datasheet; ComponentLink2Description: 2_Product page; ComponentLink3Description: 3_X-information; ComponentLink4Description: 4_X-information; Creation date: 20190101; Source: RLC_UN1Q.SchLib; Manufacturer Part Number: KGM03CS61A105MH; Component Type: Capacitor
C8 C10 C16 C22 C26 C30 C35 C43 C51 C55 C132 = CMP-001-000883-14: as C110 on sheet IMX8_PMIC; Package: 0402; ComponentLink1Description: 1_Datasheet; ComponentLink2Description: 2_Product page; ComponentLink3Description: 3_X-information; ComponentLink4Description: 4_X-information; Creation date: 26042024; Manufacturer Part Number: GMC04X6S106M6R3NT; Component Type: Capacitor
C9 C15 = CMP-001-000889-11: as C83-C85 on sheet IMX8_PHY; Package: 0201; Dimensions WxLxH: 0.35; ComponentLink1Description: 1_Datasheet; ComponentLink2Description: 2_Product page; ComponentLink3Description: 3_X-information; ComponentLink4Description: 4_X-information; Creation date: 26042024; ClassName: SMALL; Manufacturer Part Number: GRM033C81A224KE01D; Component Type: Capacitor
C60 = CMP-001-000888-12: as C112 on sheet IMX8_PMIC; ComponentLink2Description: 2_Product page; Package: 0402; Creation date: 26042024; ComponentLink1Description: 1_Datasheet; ComponentLink3Description: 3_X-information; ComponentLink4Description: 4_X-information; Manufacturer Part Number: GRT155C81A475ME13J; Component Type: Capacitor
U1 = CMP-001-000983-8: CPU QUAD CORTEX A53+M4 1.6GHZ BGA548 Industrial; Manufacturer: NXP Semiconductors; Sort order: 501; System: IC; ComponentLink1Description: 1_Datasheet; ComponentLink1URL: https://www.nxp.com/part/MIMX8ML8CVNKZAB#/; ComponentLink2Description: 2_Product page; ComponentLink3Description: 3_X-information; ComponentLink4Description: 4_X-information; Creation date: 20240524; Dimensions WxLxH: 15 x 15 x 1.33mm; Operating temperature range: -40... +105 °C; Package: FCBGA548; Part Number: MIMX8ML8CVNKZAB; ClassName: BIG; Source: UUDET_KOMPONENTIT.SchLib; Design Item ID: MIMX8ML8CVNKZAB; Manufacturer Part Number: MIMX8ML8CVNKZAB; Component Type: Processor